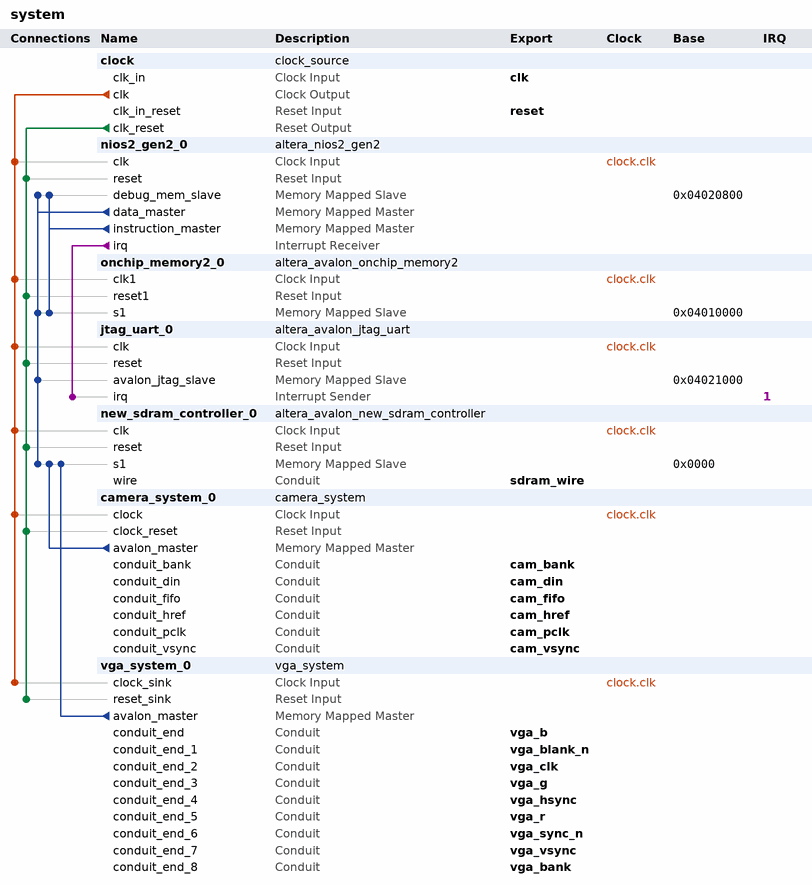
[diagram p0: system contents]
# Platform Designer (Qsys) system system, Cyclone V 5CSEMA5F31C6
# Parameters at their usual value, and those the tool derives, are not listed.
package require -exact qsys 18.1
create_system system
set_project_property DEVICE_FAMILY {Cyclone V}
set_project_property DEVICE 5CSEMA5F31C6

add_instance clock clock_source 18.1
set_instance_parameter_value clock clockFrequency 50000000

add_instance nios2_gen2_0 altera_nios2_gen2 18.1
set_instance_parameter_value nios2_gen2_0 dcache_size 2048
set_instance_parameter_value nios2_gen2_0 exceptionSlave onchip_memory2_0.s1
set_instance_parameter_value nios2_gen2_0 icache_size 4096
set_instance_parameter_value nios2_gen2_0 impl Tiny
set_instance_parameter_value nios2_gen2_0 resetSlave onchip_memory2_0.s1

add_instance onchip_memory2_0 altera_avalon_onchip_memory2 18.1
set_instance_parameter_value onchip_memory2_0 dataWidth 32
set_instance_parameter_value onchip_memory2_0 dualPort false
set_instance_parameter_value onchip_memory2_0 initMemContent true
set_instance_parameter_value onchip_memory2_0 initializationFileName onchip_mem.hex
set_instance_parameter_value onchip_memory2_0 memorySize 65536

add_instance jtag_uart_0 altera_avalon_jtag_uart 18.1
set_instance_parameter_value jtag_uart_0 simInteractiveOptions NO_INTERACTIVE_WINDOWS

add_instance new_sdram_controller_0 altera_avalon_new_sdram_controller 18.1
set_instance_parameter_value new_sdram_controller_0 TAC 5.5
set_instance_parameter_value new_sdram_controller_0 TRCD 20.0
set_instance_parameter_value new_sdram_controller_0 TRP 20.0
set_instance_parameter_value new_sdram_controller_0 casLatency 3
set_instance_parameter_value new_sdram_controller_0 columnWidth 10
set_instance_parameter_value new_sdram_controller_0 dataWidth 16
set_instance_parameter_value new_sdram_controller_0 generateSimulationModel false
set_instance_parameter_value new_sdram_controller_0 model single_Micron_MT48LC4M32B2_7_chip
set_instance_parameter_value new_sdram_controller_0 numberOfBanks 4
set_instance_parameter_value new_sdram_controller_0 numberOfChipSelects 1
set_instance_parameter_value new_sdram_controller_0 powerUpDelay 100.0
set_instance_parameter_value new_sdram_controller_0 refreshPeriod 15.625
set_instance_parameter_value new_sdram_controller_0 rowWidth 13

add_instance camera_system_0 camera_system 1.0
set_instance_parameter_value camera_system_0 ADDR_WIDTH 32
set_instance_parameter_value camera_system_0 DATA_WIDTH 16

add_instance vga_system_0 vga_system 1.0
set_instance_parameter_value vga_system_0 ADDR_WIDTH 32
set_instance_parameter_value vga_system_0 DATA_WIDTH 16

# connections
add_connection clock.clk camera_system_0.clock clock
add_connection clock.clk jtag_uart_0.clk clock
add_connection clock.clk new_sdram_controller_0.clk clock
add_connection clock.clk nios2_gen2_0.clk clock
add_connection clock.clk onchip_memory2_0.clk1 clock
add_connection clock.clk vga_system_0.clock_sink clock
add_connection clock.clk_reset camera_system_0.clock_reset reset
add_connection clock.clk_reset jtag_uart_0.reset reset
add_connection clock.clk_reset new_sdram_controller_0.reset reset
add_connection clock.clk_reset nios2_gen2_0.reset reset
add_connection clock.clk_reset onchip_memory2_0.reset1 reset
add_connection clock.clk_reset vga_system_0.reset_sink reset
add_connection camera_system_0.avalon_master new_sdram_controller_0.s1 avalon
set_connection_parameter_value camera_system_0.avalon_master/new_sdram_controller_0.s1 baseAddress 0x0000
add_connection nios2_gen2_0.data_master jtag_uart_0.avalon_jtag_slave avalon
set_connection_parameter_value nios2_gen2_0.data_master/jtag_uart_0.avalon_jtag_slave baseAddress 0x04021000
add_connection nios2_gen2_0.data_master new_sdram_controller_0.s1 avalon
set_connection_parameter_value nios2_gen2_0.data_master/new_sdram_controller_0.s1 baseAddress 0x0000
add_connection nios2_gen2_0.data_master nios2_gen2_0.debug_mem_slave avalon
set_connection_parameter_value nios2_gen2_0.data_master/nios2_gen2_0.debug_mem_slave baseAddress 0x04020800
add_connection nios2_gen2_0.data_master onchip_memory2_0.s1 avalon
set_connection_parameter_value nios2_gen2_0.data_master/onchip_memory2_0.s1 baseAddress 0x04010000
add_connection nios2_gen2_0.instruction_master nios2_gen2_0.debug_mem_slave avalon
set_connection_parameter_value nios2_gen2_0.instruction_master/nios2_gen2_0.debug_mem_slave baseAddress 0x04020800
add_connection nios2_gen2_0.instruction_master onchip_memory2_0.s1 avalon
set_connection_parameter_value nios2_gen2_0.instruction_master/onchip_memory2_0.s1 baseAddress 0x04010000
add_connection vga_system_0.avalon_master new_sdram_controller_0.s1 avalon
set_connection_parameter_value vga_system_0.avalon_master/new_sdram_controller_0.s1 baseAddress 0x0000
add_connection nios2_gen2_0.irq jtag_uart_0.irq interrupt
set_connection_parameter_value nios2_gen2_0.irq/jtag_uart_0.irq irqNumber 1

# exported interfaces
add_interface cam_bank conduit end
set_interface_property cam_bank EXPORT_OF camera_system_0.conduit_bank
add_interface cam_din conduit end
set_interface_property cam_din EXPORT_OF camera_system_0.conduit_din
add_interface cam_fifo conduit end
set_interface_property cam_fifo EXPORT_OF camera_system_0.conduit_fifo
add_interface cam_href conduit end
set_interface_property cam_href EXPORT_OF camera_system_0.conduit_href
add_interface cam_pclk conduit end
set_interface_property cam_pclk EXPORT_OF camera_system_0.conduit_pclk
add_interface cam_vsync conduit end
set_interface_property cam_vsync EXPORT_OF camera_system_0.conduit_vsync
add_interface clk clock sink
set_interface_property clk EXPORT_OF clock.clk_in
add_interface reset reset sink
set_interface_property reset EXPORT_OF clock.clk_in_reset
add_interface sdram_wire conduit end
set_interface_property sdram_wire EXPORT_OF new_sdram_controller_0.wire
add_interface vga_b conduit end
set_interface_property vga_b EXPORT_OF vga_system_0.conduit_end
add_interface vga_bank conduit end
set_interface_property vga_bank EXPORT_OF vga_system_0.conduit_end_8
add_interface vga_blank_n conduit end
set_interface_property vga_blank_n EXPORT_OF vga_system_0.conduit_end_1
add_interface vga_clk conduit end
set_interface_property vga_clk EXPORT_OF vga_system_0.conduit_end_2
add_interface vga_g conduit end
set_interface_property vga_g EXPORT_OF vga_system_0.conduit_end_3
add_interface vga_hsync conduit end
set_interface_property vga_hsync EXPORT_OF vga_system_0.conduit_end_4
add_interface vga_r conduit end
set_interface_property vga_r EXPORT_OF vga_system_0.conduit_end_5
add_interface vga_sync_n conduit end
set_interface_property vga_sync_n EXPORT_OF vga_system_0.conduit_end_6
add_interface vga_vsync conduit end
set_interface_property vga_vsync EXPORT_OF vga_system_0.conduit_end_7

set_interconnect_requirement {$system} qsys_mm.clockCrossingAdapter HANDSHAKE
set_interconnect_requirement {$system} qsys_mm.enableEccProtection FALSE
set_interconnect_requirement {$system} qsys_mm.insertDefaultSlave FALSE
set_interconnect_requirement {$system} qsys_mm.maxAdditionalLatency 1

save_system system.qsys
